# EAGLE design Group 12 (EAGLE 8.4.0)
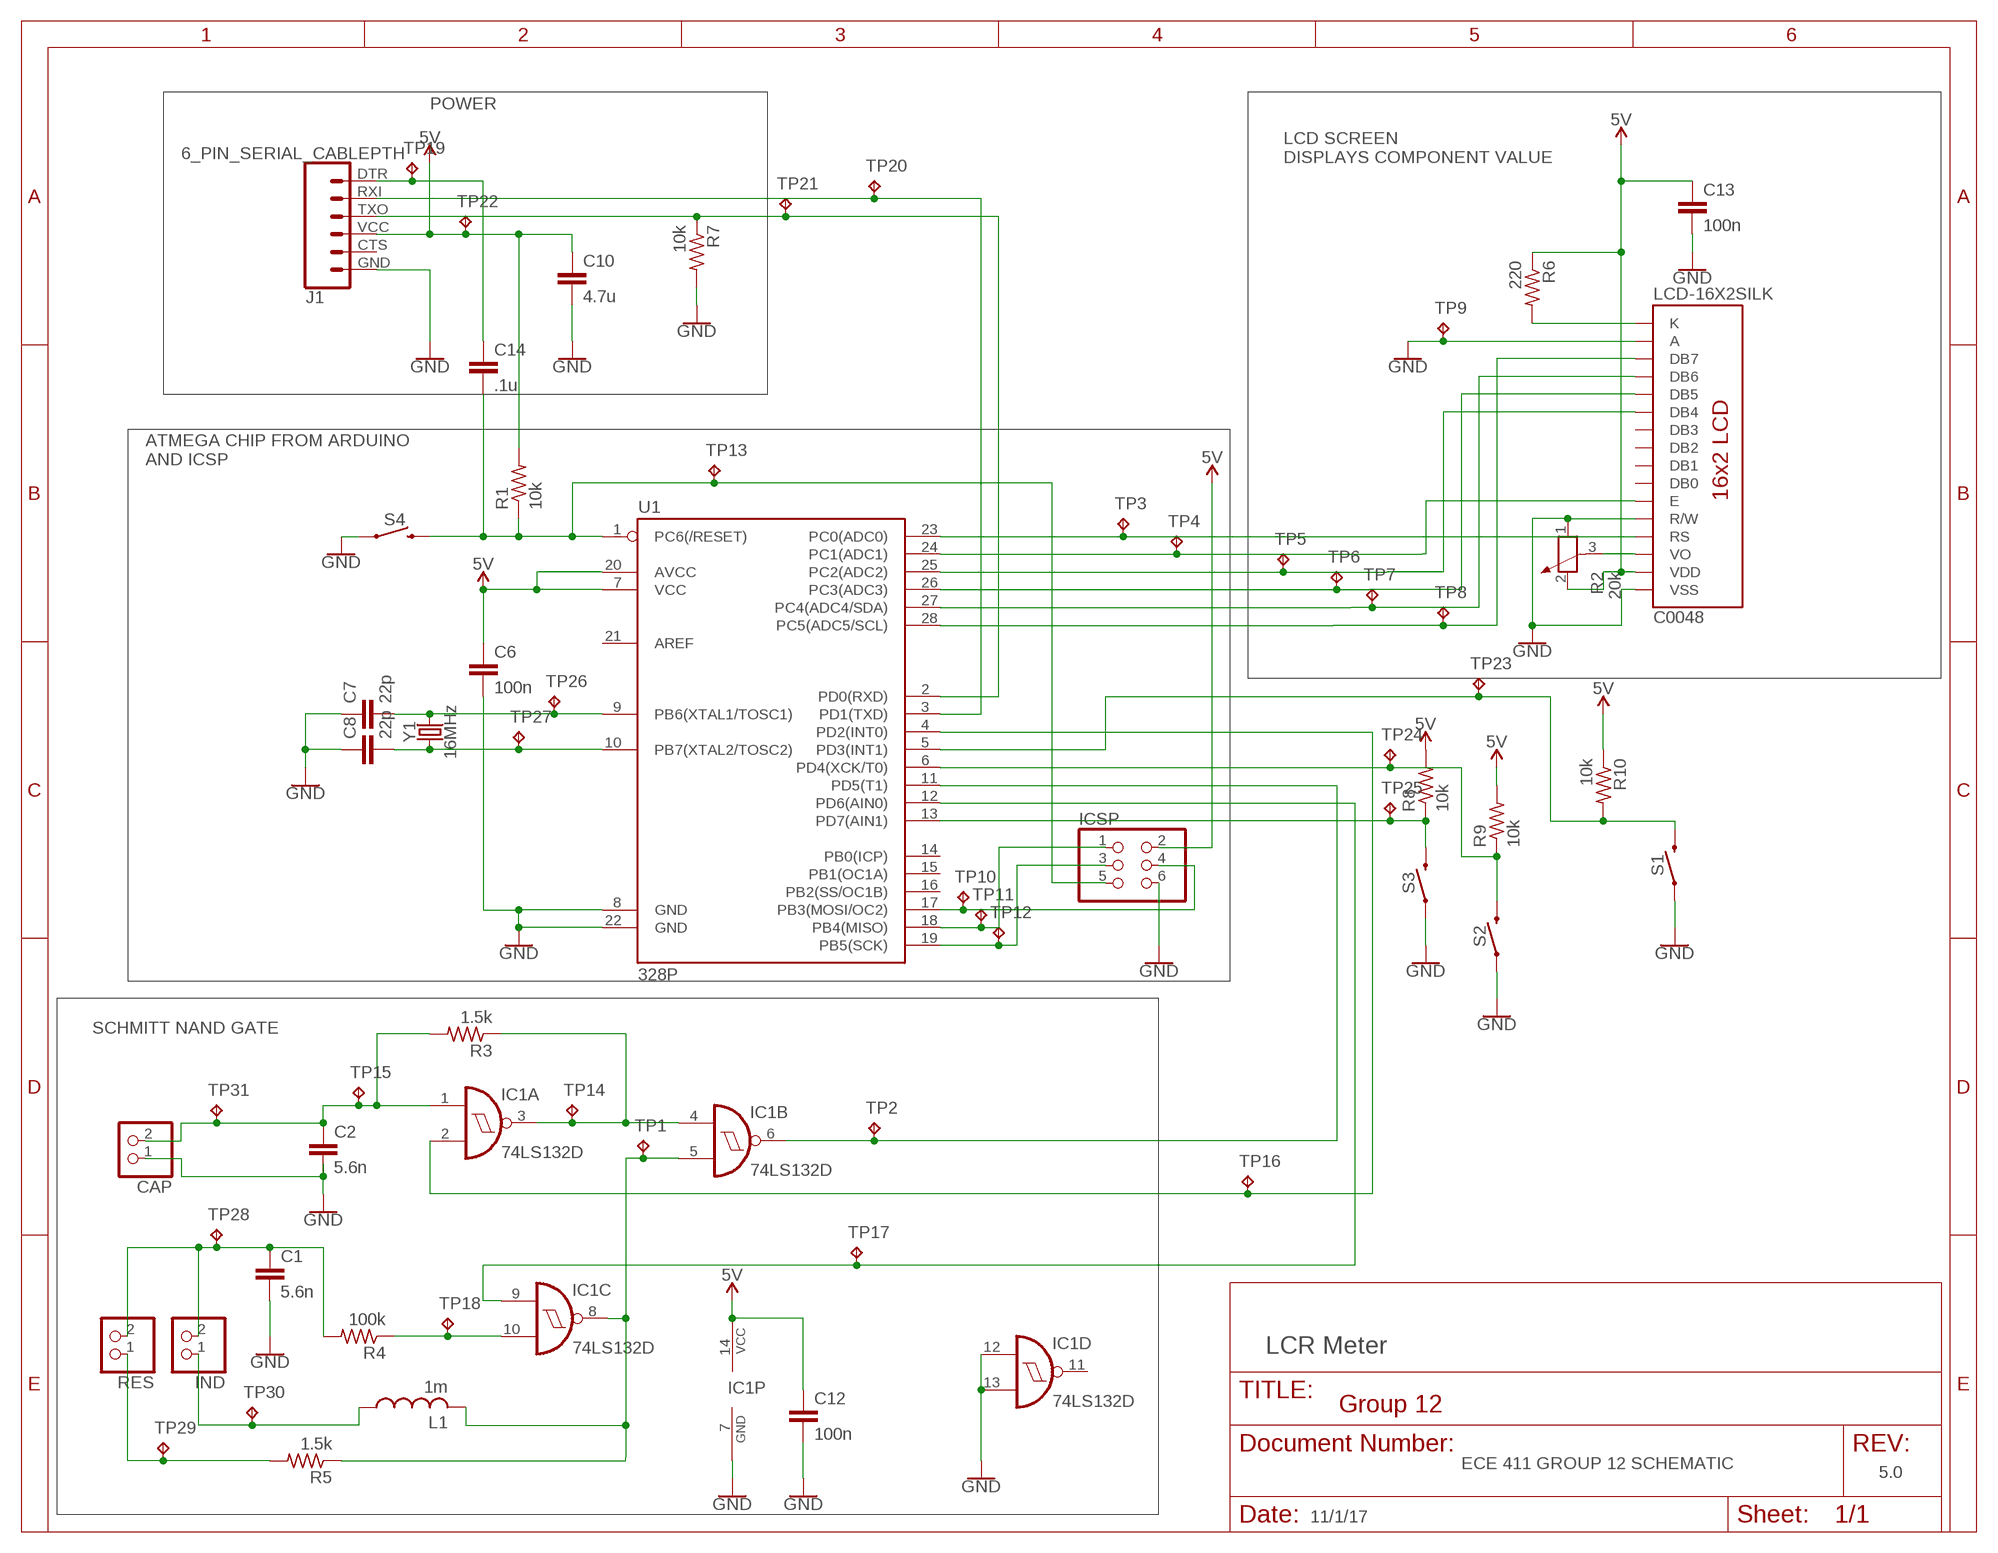
[diagram p0: schematic, sheet 1]

## Parts
C1  5.6n  C-EUC0805K  [C0805K]
C2  5.6n  C-EUC0805K  [C0805K]
C6  100n  C-EUC0805K  [C0805K]
C7  22p  C-EUC0805K  [C0805K]
C8  22p  C-EUC0805K  [C0805K]
C10  4.7u  C-EUC0805K  [C0805K]
C12  100n  C-EUC0805K  [C0805K]
C13  100n  C-EUC0805K  [C0805K]
C14  .1u  C-EUC0805K  [C0805K]
C0048  LCD-16X2SILK  [LCD-16X2]
CAP  PINHD-1X2  [1X02]
IC1  74LS132D  [SO14]
ICSP  PINHD-2X3  [2X03]
IND  PINHD-1X2  [1X02]
J1  6_PIN_SERIAL_CABLEPTH  [FTDI_BASIC]
L1  1m  L-US0204/5  [0204/5]
R1  10k  R-US_R0805  [R0805]
R2  20k  POTENTIOMETER_PT-10  [PT-10]
R3  1.5k  R-US_M0805  [M0805]
R4  100k  R-US_M0805  [M0805]
R5  1.5k  R-US_M0805  [M0805]
R6  220  R-US_R0805  [R0805]
R7  10k  R-US_R0805  [R0805]
R8  10k  R-US_R0805  [R0805]
R9  10k  R-US_R0805  [R0805]
R10  10k  R-US_R0805  [R0805]
RES  PINHD-1X2  [1X02]
S1  MOMENTARY-SWITCH-SPST-SMD-6.0X3.5MM  [TACTILE_SWITCH_SMD_6.0X3.5MM]
S2  MOMENTARY-SWITCH-SPST-SMD-6.0X3.5MM  [TACTILE_SWITCH_SMD_6.0X3.5MM]
S3  MOMENTARY-SWITCH-SPST-SMD-6.0X3.5MM  [TACTILE_SWITCH_SMD_6.0X3.5MM]
S4  MOMENTARY-SWITCH-SPST-SMD-6.0X3.5MM  [TACTILE_SWITCH_SMD_6.0X3.5MM]
TP1  TPPAD1-13  [P1-13]
TP2  TPPAD1-13  [P1-13]
TP3  TPPAD1-13  [P1-13]
TP4  TPPAD1-13  [P1-13]
TP5  TPPAD1-13  [P1-13]
TP6  TPPAD1-13  [P1-13]
TP7  TPPAD1-13  [P1-13]
TP8  TPPAD1-13  [P1-13]
TP9  TPPAD1-13  [P1-13]
TP10  TPPAD1-13  [P1-13]
TP11  TPPAD1-13  [P1-13]
TP12  TPPAD1-13  [P1-13]
TP13  TPPAD1-13  [P1-13]
TP14  TPPAD1-13  [P1-13]
TP15  TPPAD1-13  [P1-13]
TP16  TPPAD1-13  [P1-13]
TP17  TPPAD1-13  [P1-13]
TP18  TPPAD1-13  [P1-13]
TP19  TPPAD1-13  [P1-13]
TP20  TPPAD1-13  [P1-13]
TP21  TPPAD1-13  [P1-13]
TP22  TPPAD1-13  [P1-13]
TP23  TPPAD1-13  [P1-13]
TP24  TPPAD1-13  [P1-13]
TP25  TPPAD1-13  [P1-13]
TP26  TPPAD1-13  [P1-13]
TP27  TPPAD1-13  [P1-13]
TP28  TPPAD1-13  [P1-13]
TP29  TPPAD1-13  [P1-13]
TP30  TPPAD1-13  [P1-13]
TP31  TPPAD1-13  [P1-13]
U1  328P  ATMEGA328P_PDIP  [DIP28]
Y1  16MHz  CRYSTAL-16MHZSMD-5X3.2  [CRYSTAL-SMD-5X3.2-4PAD]

## Nets
5V: C6.1 C10.1 C12.1 C13.1 C0048.2(VDD) IC1.14(P:VCC) ICSP.2 J1.VCC R1.2 R2.2 R6.1 R8.2 R9.2 R10.1 TP22.TP U1.7(VCC) U1.20(AVCC)
CAL: R9.1 S2.2 TP24.TP U1.6(PD4(XCK/T0))
GND: C1.2 C2.2 C6.2 C7.1 C8.1 C10.2 C12.2 C13.2 C0048.1(VSS) C0048.5(R/W) C0048.15(A) CAP.1 IC1.7(P:GND) IC1.12(D:I0) IC1.13(D:I1) ICSP.6 J1.GND R2.1 R7.2 S1.1 S2.1 S3.1 S4.1 TP9.TP U1.8(GND) U1.22(GND)
MISO: ICSP.1 TP11.TP U1.18(PB4(MISO))
MODE: R10.2 S1.2 TP23.TP U1.5(PD3(INT1))
N$1: C2.1 CAP.2 IC1.1(A:I0) R3.2 TP15.TP TP31.TP
N$2: IC1.10(C:I1) R4.1 TP18.TP
N$3: J1.RXI TP20.TP U1.3(PD1(TXD))
N$4: ICSP.4 TP10.TP U1.17(PB3(MOSI/OC2))
N$5: IC1.3(A:O) IC1.4(B:I0) R3.1 TP14.TP
N$7: C14.1 J1.DTR TP19.TP
N$8: R5.2 RES.1 TP29.TP
N$10: IC1.5(B:I1) IC1.8(C:O) L1.2 R5.1 TP1.TP
N$14: IND.1 L1.1 TP30.TP
N$16: C1.1 IND.2 R4.2 RES.2 TP28.TP
N$20: C0048.3(VO) R2.3
N$22: C0048.16(K) R6.2
PB6: C7.2 TP26.TP U1.9(PB6(XTAL1/TOSC1)) Y1.3
PB7: C8.2 TP27.TP U1.10(PB7(XTAL2/TOSC2)) Y1.1
PC0: C0048.4(RS) TP3.TP U1.23(PC0(ADC0))
PC1: C0048.6(E) TP4.TP U1.24(PC1(ADC1))
PC2: C0048.11(DB4) TP5.TP U1.25(PC2(ADC2))
PC3: C0048.12(DB5) TP6.TP U1.26(PC3(ADC3))
PC4: C0048.13(DB6) TP7.TP U1.27(PC4(ADC4/SDA))
PC5: C0048.14(DB7) TP8.TP U1.28(PC5(ADC5/SCL))
PD0: J1.TXO R7.1 TP21.TP U1.2(PD0(RXD))
PD2: IC1.2(A:I1) TP16.TP U1.4(PD2(INT0))
PD5: IC1.6(B:O) TP2.TP U1.11(PD5(T1))
PD6: IC1.9(C:I0) TP17.TP U1.12(PD6(AIN0))
RESET: C14.2 ICSP.5 R1.1 S4.2 TP13.TP U1.1(PC6(/RESET))
SCK: ICSP.3 TP12.TP U1.19(PB5(SCK))
SET: R8.1 S3.2 TP25.TP U1.13(PD7(AIN1))
Unconnected: C0048.7(DB0) C0048.8(DB1) C0048.9(DB2) C0048.10(DB3) IC1.11(D:O) J1.CTS U1.14(PB0(ICP)) U1.15(PB1(OC1A)) U1.16(PB2(SS/OC1B)) U1.21(AREF)

## Notes on the sheet
- POWER
- LCD SCREEN
  DISPLAYS COMPONENT VALUE
- ATMEGA CHIP FROM ARDUINO
  AND ICSP
- SCHMITT NAND GATE
- LCR Meter
- ECE 411 GROUP 12 SCHEMATIC
- 5.0
- 11/1/17

## Library data of the parts
C1 C2 C6-C8 C10 C12-C14 = rcl:C-EU: CAPACITOR, European symbol
C0048 = SparkFun-Displays:LCD-16X2: Standard text-only 16x2 parallel input LCD Basic 16 character by 2 line display. Typically utilizes the extremely common HD44780 parallel interface chipset SparkFun Products: Basic 16x2 Green <https://www.sparkfun.com/products/255> Basic 8x2 Green <https://www.sparkfun.com/products/11122>; SF_ID: LCD-00255
CAP IND RES = pinhead:PINHD-1X2: PIN HEADER
IC1 = 74xx-us:74*132: Quad 2-input NAND schmitt trigger
ICSP = pinhead:PINHD-2X3: PIN HEADER
J1 = SparkFun-Connectors:6_PIN_SERIAL_CABLE: 6-pin header connection for use with the "FTDI BASIC" pinout - CABLE SIDE. Also known as "Arduino Serial Program Header". This is used on a design to provide a 6-pin connection point for serial communication usually from a USB cable (D+/D-) to these headers (RX/TX). It also has the remaining pins necessary for programming in the Arduino evironment (DTR, GND, and sometimes VCC). Note, this device has "CABLE" in the name. It is intended to be used on a design that usually lives on the end of your USB cable and prvides the converter chip (FTDI232 or FTDI231x) to commnicate serial RX/TX. The "sister" device, named "TARGET" is inteneded to be used on a design that contains a target micro-controller that you wish to program. You can populate with some of these: Female Headers <https://www.sparkfun.com/products/115> (PRT-00115) For reference (or to suit your programming needs) check out these designs: SparkFun FTDI Basic Breakout - 5V <https://www.sparkfun.com/products/9716> (DEV-09716) SparkFun FTDI Basic Breakout - 3.3V <https://www.sparkfun.com/products/9873> (DEV-09873) SparkFun FTDI SmartBasic <https://www.sparkfun.com/products/12935> (DEV-12935) SparkFun Beefy 3 - FTDI Basic Breakout <https://www.sparkfun.com/products/13746> (DEV-13746)
L1 = rcl:L-US: INDUCTOR, American symbol
R1 R3-R10 = rcl:R-US_: RESISTOR, American symbol
R2 = rcl:POTENTIOMETER_: Potentiometer
S1-S4 = SparkFun-Switches:MOMENTARY-SWITCH-SPST: Momentary Switch (Pushbutton) - SPST Normally-open (NO) SPST momentary switches (buttons, pushbuttons). Variants PTH-12MM - 12mm square, through-hole Momentary Pushbutton Switch - 12mm Square <https://www.sparkfun.com/products/9190> (COM-09190) PTH-6.0MM, PTH-6.0MM-KIT - 6.0mm square, through-hole Mini Pushbutton Switch <https://www.sparkfun.com/products/97> (COM-00097) KIT package intended for soldering kit's - only one side of pads' copper is exposed. PTH-RIGHT-ANGLE-KIT - Right-angle, through-hole Right Angle Tactile Button <https://www.sparkfun.com/products/10791> - Used on SparkFun BigTime Watch Kit <https://www.sparkfun.com/products/11734> SMD-12MM - 12mm square, surface-mount Tactile Button - SMD (12mm) <https://www.sparkfun.com/products/12993> (COM-12993) Used on SparkFun PicoBoard <https://www.sparkfun.com/products/11888> SMD-4.5MM - 4.5mm Square Trackball Switch Used on SparkFun Blackberry Trackballer Breakout <https://www.sparkfun.com/products/13169> SMD-4.6MMX2.8MM - 4.60mm x 2.80mm, surface mount Used on SparkFun SAMD21 Mini Breakout <https://www.sparkfun.com/products/13664> SMD-5.2MM, SMD-5.2-REDUNDANT - 5.2mm square, surface-mount Mini Pushbutton Switch - SMD <https://www.sparkfun.com/products/8720> (COM-08720) Used on Arduino Pro Mini <https://www.sparkfun.com/products/11114> REDUNDANT package connects both switch circuits together SMD-6.0X3.5MM - 6.0 x 3.5mm, surface mount Momentary Reset Switch SMD <https://www.sparkfun.com/products/8229> (COM-08229) SMD-6.2MM-TALL - 6.2mm square, surface mount Tactile Button - SMD (6mm) <https://www.sparkfun.com/products/12992> Used on SparkFun Digital Sandbox <https://www.sparkfun.com/products/12651> SMD-RIGHT-ANGLE - Right-angle, surface mount Used on SparkFun Block for Intel® Edison - Arduino <https://www.sparkfun.com/products/13036>; PROD_ID: SWCH-00815; SF_SKU: COM-08229
TP1-TP31 = testpad:TP: Test pad
U1 = SparkFun-IC-Microcontroller:ATMEGA328P_PDIP: Atmel 328P Through hole ATMEGA328P uC used in the Arduino 32kb flash, 1k EEPROM, 2k SRAM Datasheet <http://www.sparkfun.com/datasheets/Components/SMD/ATMega328.pdf> SparkFun Products Storefront component: AVR 28 Pin 20MHz 32K 6A/D - ATMega328P <https://www.sparkfun.com/products/9061> (COM-09061) SparkFun Simon Says - Through-Hole Soldering Kit <https://www.sparkfun.com/products/10547> (KIT-10547) SparkFun Learn to Solder - Simon Says <https://www.sparkfun.com/products/13708> (KIT-13708) SparkFun BigTime Watch Kit <https://www.sparkfun.com/products/11734> (KIT-11734) SparkFun ClockIt <https://www.sparkfun.com/products/10930> (KIT-10930) SparkFun Serial Enabled LCD Kit <https://www.sparkfun.com/products/10097> (LCD-10097) SparkFun Simon Tilts - Through Hole Soldering Kit <https://www.sparkfun.com/products/12634> (KIT-12634) SparkFun Frequency Counter Kit <https://www.sparkfun.com/products/10140> (KIT-10140) FabFM Radio Kit <https://www.sparkfun.com/products/11043> (KIT-11043) SparkFun Binary Blaster Kit <https://www.sparkfun.com/products/12037> (KIT-12037) SparkFun Metro-Gnome <https://www.sparkfun.com/products/9236> (KIT-09236) ATmega328 with Arduino Optiboot (Uno) <https://www.sparkfun.com/products/10524> (DEV-10524); PROD_ID: IC-09136
Y1 = SparkFun-Clocks:CRYSTAL-16MHZ: 16MHz Crystal Digikey Example <http://www.digikey.com/product-search/en?keywords=535-9122-1-ND> Frequency: 16MHz Frequency Stability: ±50ppm Frequency Tolerance: ±20ppm Load Capacitance: 18pF SparkFun Products: Pro Micro -5V/16MHz <https://www.sparkfun.com/products/12640> SparkFun Serial Enabled LCD Kit <https://www.sparkfun.com/products/10097>; PROD_ID: XTAL-08218; SF_ID: COM-00094

## Board
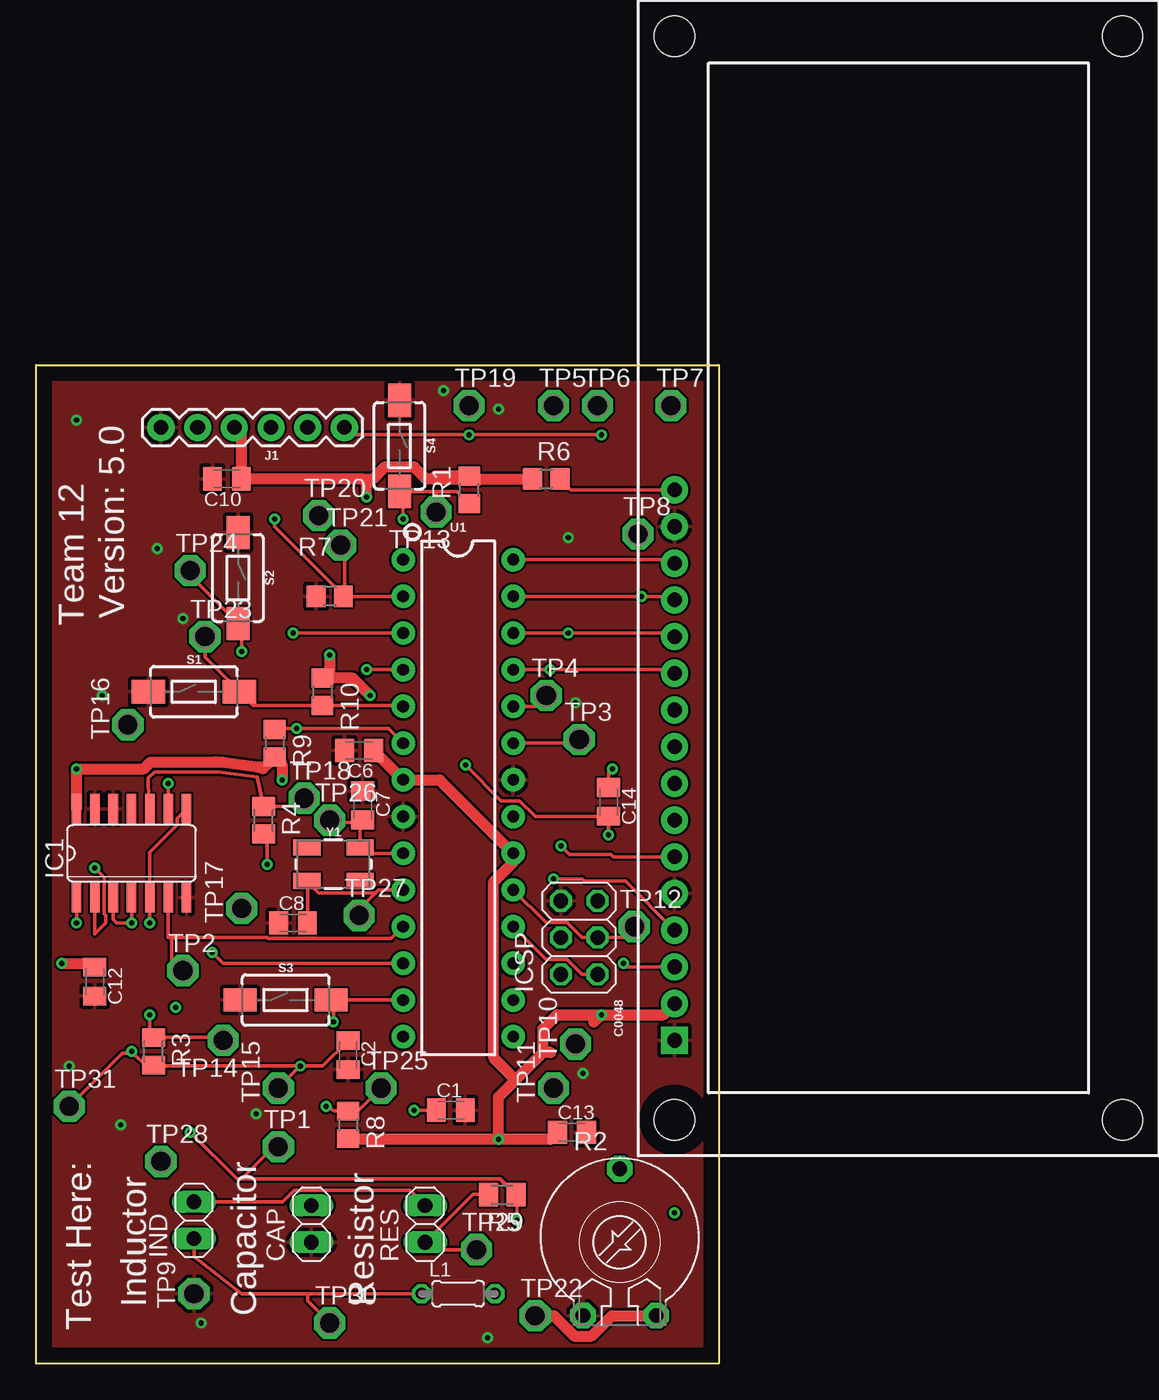
[diagram p1: board, top side]
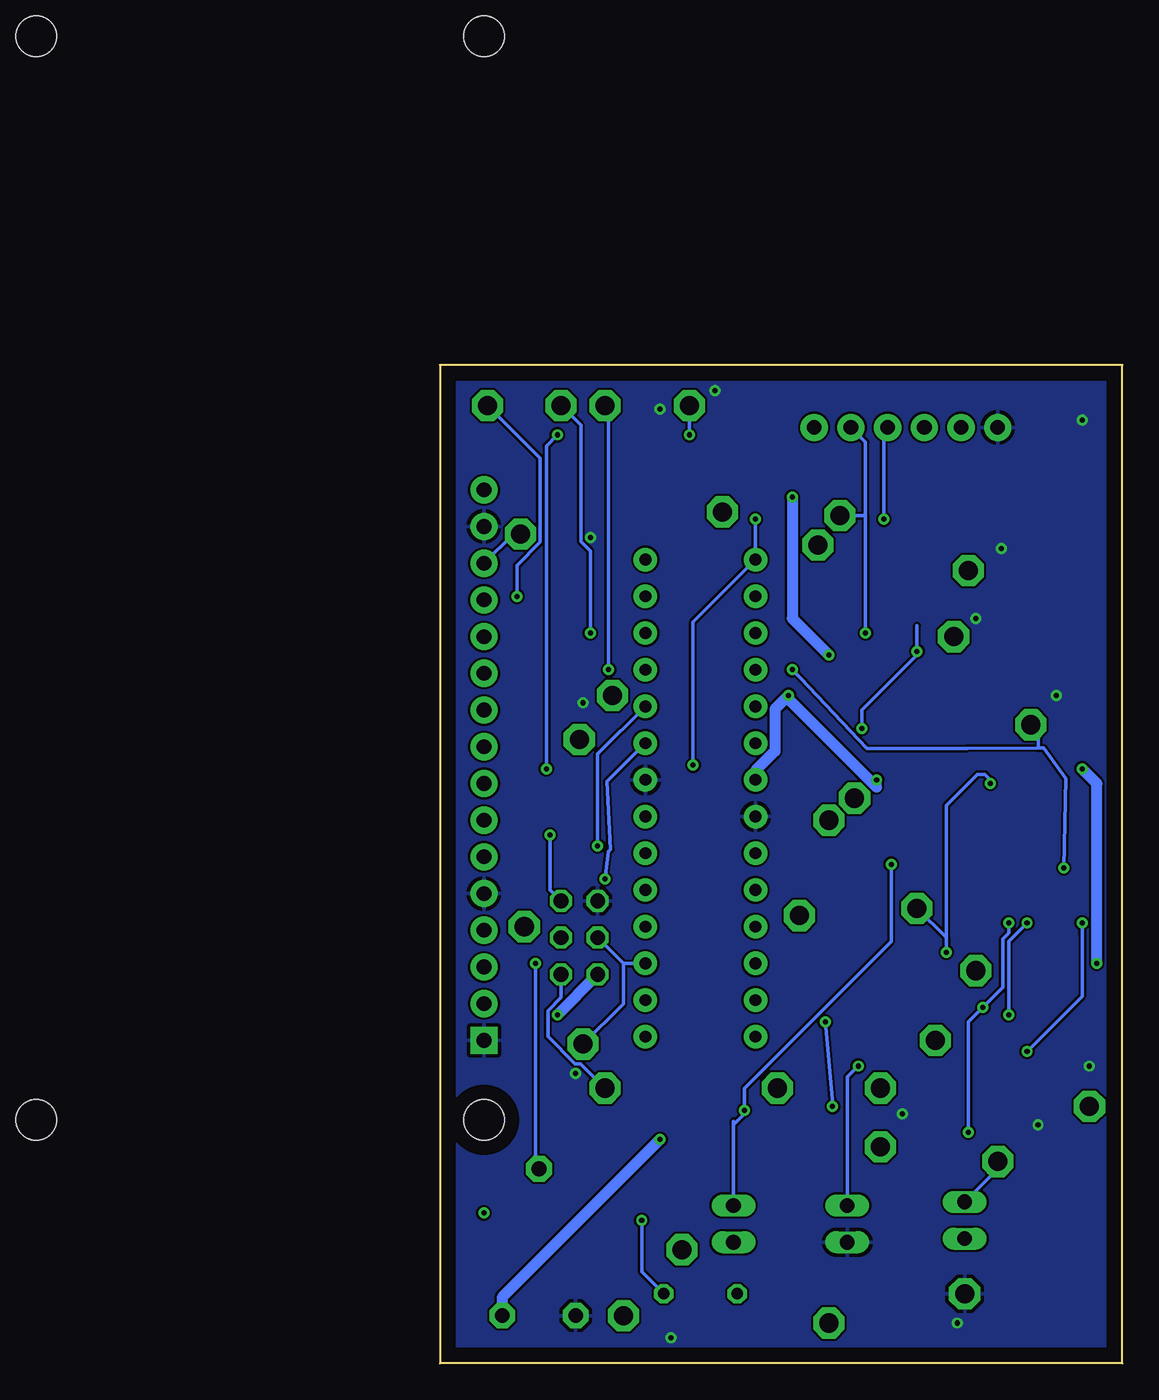
[diagram p2: board, bottom side, seen from below]

Size 47.24 x 69.09 mm. Coordinates in mm from the lower left corner, seen from the top.
Outline: 0,0 0,69.09 47.24,69.09 47.24,0 0,0
Copper layers (1*16): Top 0.035mm / dielectric 1.5mm / Bottom 0.035mm
Design rules "default": minimum track width 6mil, minimum drill 0.35mm, track to track 6mil, track to pad 6mil, pad to pad 6mil, via to via 6mil, smd to smd 6mil, copper to edge 40mil, drill to drill 6mil, minimum pad ring 10mil, minimum via ring 8mil, stop-mask expansion 4mil, vias tented up to drill 0mil, thermal gap 10mil

### Footprints (pad centres in the part's own frame; a part is rotated, then mirrored left to right if it is on the bottom)
C0805K = smd 1.3 x 1.6: 1 -1,0; 2 1,0
LCD-16X2 = drill 1.016 pad 1.88 square: 1 -32,15.5 | drill 1.016 pad 1.88: 2 -29.46,15.5; 3 -26.92,15.5; 4 -24.38,15.5; 5 -21.84,15.5; 6 -19.3,15.5; 7 -16.76,15.5; 8 -14.22,15.5; 9 -11.68,15.5; 10 -9.14,15.5; 11 -6.6,15.5; 12 -4.06,15.5; 13 -1.52,15.5; 14 1.02,15.5; 15 3.56,15.5; 16 6.1,15.5 | hole 2.8: -37.5,15.5; -37.5,-15.5; 37.5,15.5; 37.5,-15.5
1X02 = drill 1.016 long: 1 -1.27,0; 2 1.27,0
SO14 = smd 0.66 x 2.032: 1 -3.81,-3.073; 2 -2.54,-3.073; 3 -1.27,-3.073; 4 0,-3.073; 5 1.27,-3.073; 6 2.54,-3.073; 7 3.81,-3.073; 8 3.81,3.073; 9 2.54,3.073; 10 1.27,3.073; 11 0,3.073; 12 -1.27,3.073; 13 -2.54,3.073; 14 -3.81,3.073
2X03 = drill 1.016 octagon: 1 -2.54,-1.27; 2 -2.54,1.27; 3 0,-1.27; 4 0,1.27; 5 2.54,-1.27; 6 2.54,1.27
FTDI_BASIC = drill 1.016 pad 1.88: CTS 10.16,0; DTR 0,0; GND 12.7,0; RXI 2.54,0; TXO 5.08,0; VCC 7.62,0
0204/5 = drill 0.813 octagon: 1 -2.54,0; 2 2.54,0
R0805 = smd 1.3 x 1.5: 1 -0.95,0; 2 0.95,0
PT-10 = drill 1.016 pad 1.778 octagon: 1 -2.54,-5.08; 2 2.54,-5.08; 3 0,5.08
M0805 = smd 1.3 x 1.6: 1 -0.95,0; 2 0.95,0
TACTILE_SWITCH_SMD_6.0X3.5MM = smd 2.3 x 1.6: 1 -3.15,0; 2 3.15,0
P1-13 = drill 1.321 pad 2.159 octagon: TP 0,0
DIP28 = drill 0.813 pad 1.626: 1 -16.51,-3.81; 2 -13.97,-3.81; 3 -11.43,-3.81; 4 -8.89,-3.81; 5 -6.35,-3.81; 6 -3.81,-3.81; 7 -1.27,-3.81; 8 1.27,-3.81; 9 3.81,-3.81; 10 6.35,-3.81; 11 8.89,-3.81; 12 11.43,-3.81; 13 13.97,-3.81; 14 16.51,-3.81; 15 16.51,3.81; 16 13.97,3.81; 17 11.43,3.81; 18 8.89,3.81; 19 6.35,3.81; 20 3.81,3.81; 21 1.27,3.81; 22 -1.27,3.81; 23 -3.81,3.81; 24 -6.35,3.81; 25 -8.89,3.81; 26 -11.43,3.81; 27 -13.97,3.81; 28 -16.51,3.81
CRYSTAL-SMD-5X3.2-4PAD = smd 1.9 x 1.1: 1 -1.85,-1.15; 2 1.85,-1.15; 3 1.85,1.15; 4 -1.85,1.15

### Placement (x,y rotation side)
C1  28.7,17.53 0 top
C2  21.59,21.34 270 top
C6  22.35,42.42 180 top
C7  22.61,38.61 270 top
C8  17.78,30.48 0 top
C10  13.21,61.21 180 top
C12  4.06,26.42 270 top
C13  37.08,16 0 top
C14  39.62,38.86 270 top
C0048  59.69,54.36 90 top
CAP  19.05,9.65 90 top
IC1  6.6,35.31 0 top
ICSP  37.59,29.46 90 top
IND  10.92,9.91 90 top
J1  21.34,64.77 180 top
L1  29.21,4.83 0 top
R1  29.97,60.45 90 top
R2  40.39,8.38 0 top
R3  8.13,21.59 270 top
R4  15.75,37.59 270 top
R5  32.26,11.68 180 top
R6  35.31,61.21 0 top
R7  20.32,53.09 180 top
R8  21.59,16.51 270 top
R9  16.51,42.93 270 top
R10  19.81,46.48 270 top
RES  26.92,9.65 90 top
S1  10.92,46.48 0 top
S2  13.97,54.36 270 top
S3  17.27,25.15 0 top
S4  25.15,63.5 270 top
TP1  16.76,14.99 0 top
TP2  10.16,27.18 0 top
TP3  37.59,43.18 0 top
TP4  35.31,46.23 0 top
TP5  35.81,66.29 0 top
TP6  38.86,66.29 0 top
TP7  43.94,66.29 0 top
TP8  41.66,57.4 0 top
TP9  10.92,4.83 90 top
TP10  37.34,22.1 90 top
TP11  35.81,19.05 90 top
TP12  41.4,30.23 0 top
TP13  27.69,58.93 180 top
TP14  12.95,22.35 180 top
TP15  16.76,19.05 90 top
TP16  6.35,44.2 90 top
TP17  14.22,31.5 90 top
TP18  18.54,39.12 0 top
TP19  29.97,66.29 0 top
TP20  19.56,58.67 0 top
TP21  21.08,56.64 0 top
TP22  34.54,3.3 0 top
TP23  11.68,50.29 0 top
TP24  10.67,54.86 0 top
TP25  23.88,19.05 0 top
TP26  20.32,37.59 0 top
TP27  22.35,30.99 0 top
TP28  8.64,13.97 0 top
TP29  30.48,7.87 0 top
TP30  20.32,2.79 0 top
TP31  2.29,17.78 0 top
U1  29.21,39.12 270 top
Y1  20.57,34.54 0 top

### Tracks (layer width: path | path; a pad name or v marks a point on that pad's centre or on a via)
5V  (via drill 0.35)
  Top 0.762: 34.59,21.03 33.2,19.64 | 35.08,21.52 34.59,21.03 | 27.43,61.21 R6.1 | 27.43,61.21 26.99,61.21 26.17,62.03 24.12,62.03 23.31,61.21 22.61,61.21 | 22.61,61.21 C10.1 14.21,64.28 J1.VCC | v22.86,59.94 22.86,60.96 22.61,61.21 | v20.32,49.02 20.32,47.94 R10.1 21.91,47.43 v23.11,46.23 | C6.1 25.38,40.39 U1.7 27.94,40.39 U1.20 33.02,34.67 31.67,33.32 31.67,21.16 33.2,19.64 | R1.2 27.62,61.4 27.43,61.21 | v17.02,40.39 17.02,41.47 R9.2 15.69,41.15 15.66,41.19 15.53,41.21 15.42,41.28 15.36,41.26 12.91,41.6 12.68,41.6 12.46,41.64 12.42,41.6 7.92,41.6 7.46,41.15 v2.79,41.15 IC1.14 | v32,15.49 21.66,15.49 R8.2 | v32,15.49 32,18.44 33.2,19.64 | v1.78,27.69 3.79,27.69 C12.1 | C0048.2 43.42,24.13 v39.12,24.13 | 35.08,21.52 35.08,23.14 36.07,24.13 v39.12,24.13 | v39.12,24.13 38.61,23.62 | 34.59,21.02 34.59,21.03 | 35.63,21.52 35.08,21.52 | C13.1 35.58,15.49 v32,15.49 | TP22.TP 35.83,3.3 37.26,1.88 38.44,1.88 39.86,3.3 R2.2
  Bottom 0.762: v32,15.49 42.93,4.57 R2.2 | v22.86,59.94 22.86,51.56 v20.32,49.02 | U1.7 25.4,41.02 24.05,42.37 24.05,45.29 v23.11,46.23 23.11,45.97 17.02,39.88 v17.02,40.39 | v1.78,27.69 1.78,40.13 v2.79,41.15 | v39.12,24.13 ICSP.2
CAL  (via drill 0.35)
  Top 0.254: v14.22,49.28 14.22,50.95 S2.2 10.67,54.51 TP24.TP | R9.1 16.58,43.94 v18.03,43.94 24.38,43.94 U1.6
  Bottom 0.254: 14.22,51.05 v14.22,49.28 14.22,49.02 18.03,45.21 v18.03,43.94
GND  (via drill 0.35)
  other vias: 28.19,67.31 32,66.04 36.83,57.15 37.85,20.07 2.79,65.28 8.38,56.39 10.16,51.56 4.57,46.23 37.34,45.72 15.24,17.27 5.84,16.51 2.29,20.57 31.24,1.78 11.43,2.79
  pour Top: 0,69.09 0,0 47.24,0 47.24,69.09
  pour Bottom: 0,69.09 0,0 47.24,0 47.24,69.09
MISO
  Top 0.254: U1.18 35.28,27.96 36.75,27.96 37.8,26.92 ICSP.1
  Bottom 0.254: ICSP.1 38.86,25.32 39.78,24.4 39.78,22.61 37.9,20.74 37.5,20.74 TP11.TP
MODE
  Top 0.254: U1.5 25.33,45.53 R10.2 15.02,45.53 S1.2 11.68,48.87 TP23.TP
N$1  (via drill 0.35)
  Top 0.254: v2.79,30.48 IC1.1 | v18.29,20.57 19.83,20.57 C2.1 | 8.19,20.57 v18.29,20.57 | 8.19,20.57 R3.2 | 6.73,21.46 v6.6,21.59 | 6.73,21.46 7.62,20.57 8.19,20.57 | TP31.TP 5.97,21.46 6.73,21.46 | TP15.TP v18.29,20.57
  Bottom 0.254: CAP.2 19.05,19.81 v18.29,20.57 | 2.79,29.72 v2.79,30.48 2.79,25.4 v6.6,21.59
N$2
  Top 0.254: IC1.10 7.77,40.06 7.77,40.53 8.19,40.95 12.64,40.95 15.29,40.57 R4.1 17.97,38.54 TP18.TP
N$3  (via drill 0.35)
  Top 0.254: U1.3 v17.78,50.55
  Bottom 0.254: 17.78,58.67 v17.78,50.55 | 17.78,58.67 17.78,63.75 J1.RXI | TP20.TP 17.78,58.67
N$4
  Bottom 0.254: 34.54,27.69 ICSP.4 | 34.54,27.69 U1.17 | TP10.TP 34.54,24.89 34.54,27.69
N$5  (via drill 0.35)
  Top 0.254: v7.87,24.13 7.87,22.79 8.1,22.57 | 8.1,22.57 R3.1 | IC1.4 v6.6,30.48 5.59,30.48 5.33,30.73 IC1.3 | TP14.TP 12.73,22.57 8.1,22.57
  Bottom 0.254: v7.87,24.13 7.87,29.21 v6.6,30.48
N$7  (via drill 0.35)
  Top 0.254: v39.12,64.26 v29.97,64.26 21.84,64.26 J1.DTR | v39.88,41.15 39.62,40.89 C14.1
  Bottom 0.254: v39.12,64.26 39.88,63.5 v39.88,41.15 | v29.97,64.26 TP19.TP
N$8
  Top 0.254: R5.2 30.23,11.68 RES.1 27.43,7.87 TP29.TP
N$10  (via drill 0.35)
  Top 0.254: 32.07,12.76 33.15,11.68 33.27,11.56 v33.27,9.91 | v10.67,16 13.91,12.76 14.22,12.76 | 14.22,12.76 32.07,12.76 | IC1.8 9.75,37.72 9.75,37.25 7.87,35.37 IC1.5 v7.87,30.48 | TP1.TP 16.45,14.99 14.22,12.76 | R5.1 32.13,12.76 32.07,12.76
  Bottom 0.254: L1.2 33.27,6.35 v33.27,9.91 | v7.87,30.48 7.87,29.79 8.28,29.38 8.28,26.01 v9.65,24.64 10.67,23.62 v10.67,16
N$14
  Top 0.254: IND.1 10.92,7.37 14.22,4.83 18.8,4.83 | 18.8,4.83 L1.1 | TP30.TP 18.8,4.32 18.8,4.83
N$16  (via drill 0.35)
  Top 0.254: IND.2 17.07,11.18 17.86,11.96 25.88,11.96 RES.2 | v26.16,17.53 C1.1 | v16,34.54 16,36.39 R4.2
  Bottom 0.254: 26.92,16.51 RES.2 | 26.92,16.51 26.92,16.76 | v16,34.54 16,29.21 26.16,19.05 v26.16,17.53 26.16,17.27 26.92,16.51 | IND.2 8.64,13.46 TP28.TP
N$20  (via drill 0.35)
  Top 0.254: C0048.3 40.89,27.44 v40.64,27.69
  Bottom 0.254: v40.64,27.69 40.64,13.72 R2.3
N$22
  Top 0.254: C0048.16 37.01,60.46 R6.2
N$23  (via drill 0.35)
  other vias: 44.2,10.41
PB6
  Top 0.254: U1.9 22.81,35.31 Y1.3 22.42,37.43 | 22.42,37.43 C7.2 | TP26.TP 20.49,37.43 22.42,37.43
PB7
  Top 0.254: U1.10 23.69,32.77 23.49,32.56 | 23.49,32.56 19.55,32.56 18.82,33.3 | 18.82,33.3 Y1.1 | C8.2 18.78,33.26 18.82,33.3 | TP27.TP 22.35,31.43 23.49,32.56
PC0  (via drill 0.35)
  Top 0.254: v35.81,33.53 37.8,33.53 37.95,33.38 40.79,33.38 C0048.4 | TP3.TP 37.34,42.93 U1.23
  Bottom 0.254: v35.81,33.53 35.56,35.43 35.44,35.55 35.69,40.26 U1.23
PC1  (via drill 0.35)
  Top 0.254: C0048.6 39.96,35.06 39.78,35.23 36.9,35.23 v36.32,35.81 | TP4.TP 34.54,45.47 U1.24
  Bottom 0.254: v36.32,35.81 36.32,42.16 U1.24
PC2  (via drill 0.35)
  Top 0.254: U1.25 v35.56,48.01 43.94,48.01 C0048.11
  Bottom 0.254: v35.56,48.01 35.56,66.04 TP5.TP
PC3  (via drill 0.35)
  Top 0.254: U1.26 v36.83,50.55 43.94,50.55 C0048.12
  Bottom 0.254: v36.83,50.55 36.83,56.22 37.49,56.88 37.49,64.92 TP6.TP
PC4  (via drill 0.35)
  Top 0.254: U1.27 v41.91,53.09 43.94,53.09 C0048.13
  Bottom 0.254: v41.91,53.09 41.91,55.23 40.3,56.84 40.3,62.65 TP7.TP
PC5
  Top 0.254: U1.28 44.19,55.63 C0048.14
  Bottom 0.254: C0048.14 42.16,57.4 TP8.TP
PD0  (via drill 0.35)
  Top 0.254: 21.34,53.09 R7.1 | 21.34,53.09 U1.2 | v16.51,58.42 16.51,57.91 21.34,53.09 | TP21.TP 21.34,56.39 21.34,53.09
  Bottom 0.254: v16.51,58.42 16.51,64.52 J1.TXO
PD2  (via drill 0.35)
  Top 0.254: v4.06,34.29 4.72,33.63 4.72,31.1 4.83,31 4.83,30.48 4.06,29.72 IC1.2 | v22.86,48.01 U1.4
  Bottom 0.254: v22.86,48.01 17.68,42.57 10.75,42.57 5.84,42.59 | v4.06,34.29 3.91,40.49 5.44,42.59 5.84,42.59 | TP16.TP 5.84,43.69 5.84,42.59
PD5
  Top 0.254: 9.4,29.46 15.95,29.46 16.01,29.4 24.57,29.4 U1.11 | 9.4,29.46 9.14,29.46 IC1.6 | TP2.TP 9.4,27.94 9.4,29.46
PD6  (via drill 0.35)
  Top 0.254: U1.12 12.95,27.69 v12.19,28.45 | v9.14,40.13 IC1.9
  Bottom 0.254: v9.14,40.13 9.14,40.39 9.53,40.77 10.03,40.77 12.19,38.61 v12.19,28.45 12.19,29.46 TP17.TP
RESET  (via drill 0.35)
  Top 0.254: 25.4,60.35 S4.2 | 27.69,60.35 25.4,60.35 | 27.69,60.35 29.12,60.35 R1.1 | v29.72,41.4 32.18,38.94 33.47,38.94 34.55,37.86 C14.2 v39.62,36.58 | v25.4,58.42 25.4,60.35 | TP13.TP 27.69,60.35
  Bottom 0.254: v25.4,58.42 U1.1 29.72,51.31 v29.72,41.4 | ICSP.5 39.62,32.77 v39.62,36.58
SCK
  Top 0.254: U1.19 35.28,30.5 36.75,30.5 37.8,29.46 ICSP.3 40.64,29.46 TP12.TP
SET  (via drill 0.35)
  Top 0.254: 20.57,25.15 U1.13 | 20.57,25.15 S3.2 | v20.57,23.62 20.57,25.15 | v20.07,17.78 20.64,17.46 R8.1 22.29,17.46 TP25.TP
  Bottom 0.254: v20.07,17.78 20.07,18.29 v20.57,23.62

### Text on the board
tPlace: Version: 5.0 | Team 12 | Test Here: | Capacitor | Inductor | Resistor